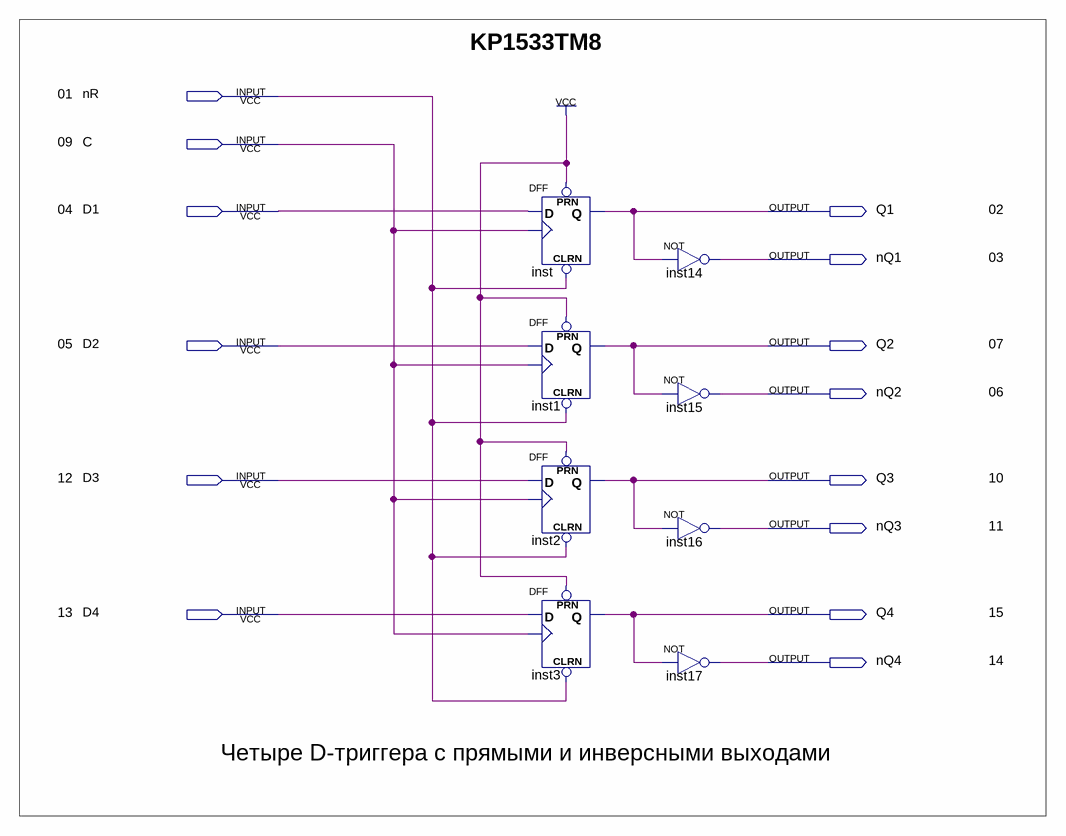
[diagram p0: schematic sheet]
// Quartus schematic KP1533TM8.bdf as structural Verilog: 8 symbols, 14 pins
module KP1533TM8 (
  input  nR,
  input  C,
  input  D1,
  input  D2,
  input  D3,
  input  D4,
  output Q1,
  output nQ1,
  output Q2,
  output nQ2,
  output Q3,
  output nQ3,
  output Q4,
  output nQ4
);

  DFF inst (.CLRN(nR), .CLK(C), .D(D1), .PRN(1'b1), .Q(Q1));
  DFF inst1 (.CLRN(nR), .CLK(C), .D(D2), .PRN(1'b1), .Q(Q2));
  DFF inst2 (.CLRN(nR), .CLK(C), .D(D3), .PRN(1'b1), .Q(Q3));
  DFF inst3 (.CLRN(nR), .CLK(C), .D(D4), .PRN(1'b1), .Q(Q4));
  not inst14 (nQ1, Q1);
  not inst15 (nQ2, Q2);
  not inst16 (nQ3, Q3);
  not inst17 (nQ4, Q4);

  // Notes on the sheet:
  //   KP1533TM8
  //   01
  //   09
  //   04
  //   02
  //   03
  //   05
  //   07
  //   06
  //   12
  //   10
  //   11
  //   13
  //   15
  //   14
  //   Четыре D-триггера с прямыми и инверсными выходами
endmodule
